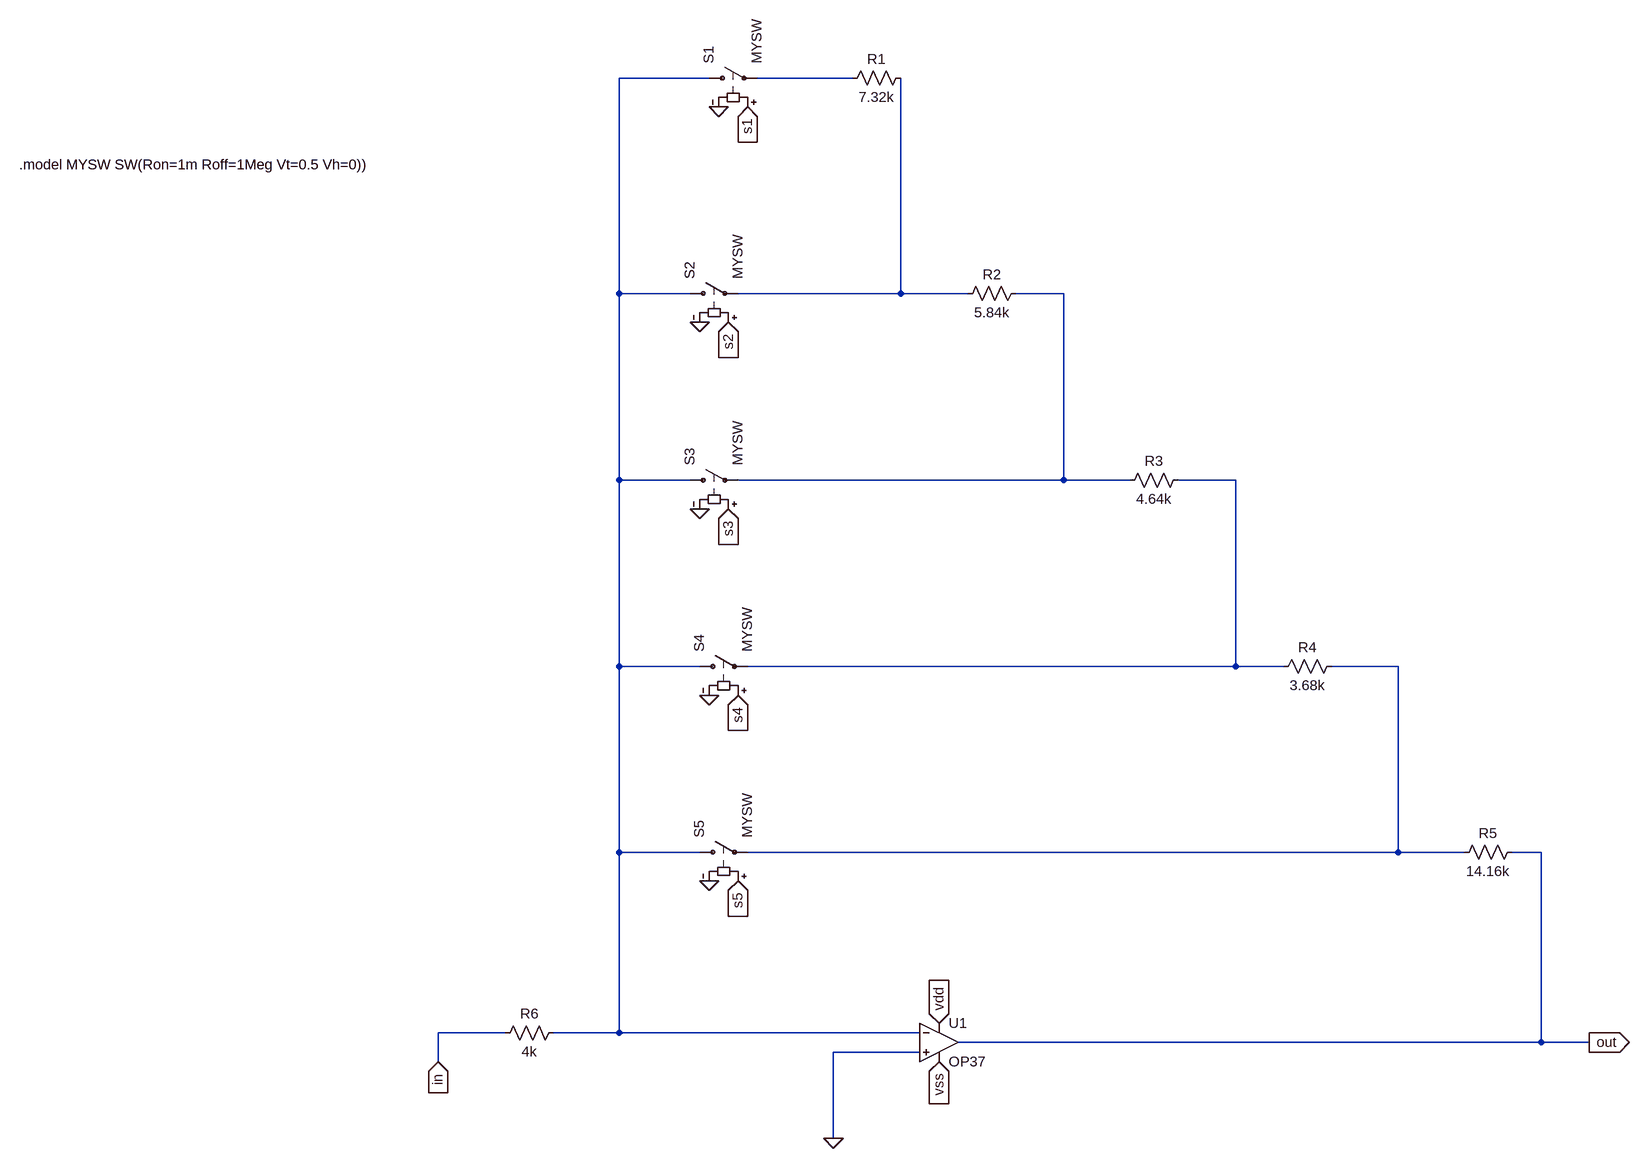
[diagram p0: schematic etj3.asc]
etj3.asc, the LTspice schematic file:
Version 4
SHEET 1 2480 2132
WIRE 736 -288 448 -288
WIRE 1040 -288 816 -288
WIRE 448 96 448 -288
WIRE 704 96 448 96
WIRE 1120 96 1120 -288
WIRE 1120 96 784 96
WIRE 1232 96 1120 96
WIRE 1392 96 1312 96
WIRE 448 544 448 96
WIRE 704 544 448 544
WIRE 1392 544 1392 96
WIRE 1392 544 784 544
WIRE 1504 544 1392 544
WIRE 1680 544 1584 544
WIRE 448 1008 448 544
WIRE 720 1008 448 1008
WIRE 1680 1008 1680 544
WIRE 1680 1008 800 1008
WIRE 1760 1008 1680 1008
WIRE 1968 1008 1840 1008
WIRE 448 1456 448 1008
WIRE 720 1456 448 1456
WIRE 1968 1456 1968 1008
WIRE 1968 1456 800 1456
WIRE 2176 1456 1968 1456
WIRE 2304 1456 2256 1456
WIRE 48 1904 -64 1904
WIRE 448 1904 448 1456
WIRE 448 1904 128 1904
WIRE 1152 1904 448 1904
WIRE 2304 1920 2304 1456
WIRE 2304 1920 1216 1920
WIRE 2384 1920 2304 1920
WIRE 1152 1936 1008 1936
WIRE -64 1952 -64 1904
WIRE 1008 2080 1008 1936
FLAG 1008 2080 0
FLAG 752 -240 0
FLAG 720 592 0
FLAG 736 1056 0
FLAG 736 1504 0
FLAG 800 -240 s1
IOPIN 800 -240 In
FLAG 720 144 0
FLAG 768 144 s2
IOPIN 768 144 In
FLAG 768 592 s3
IOPIN 768 592 In
FLAG 784 1056 s4
IOPIN 784 1056 In
FLAG 784 1504 s5
IOPIN 784 1504 In
FLAG 1184 1888 vdd
IOPIN 1184 1888 In
FLAG 1184 1952 vss
IOPIN 1184 1952 In
FLAG -64 1952 in
IOPIN -64 1952 In
FLAG 2384 1920 out
IOPIN 2384 1920 Out
DATAFLAG 2304 1920 ""
SYMBOL res 1136 -304 R90
WINDOW 0 0 56 VBottom 2
WINDOW 3 32 56 VTop 2
SYMATTR InstName R1
SYMATTR Value 7.32k
SYMBOL res 1328 80 R90
WINDOW 0 0 56 VBottom 2
WINDOW 3 32 56 VTop 2
SYMATTR InstName R2
SYMATTR Value 5.84k
SYMBOL res 1600 528 R90
WINDOW 0 0 56 VBottom 2
WINDOW 3 32 56 VTop 2
SYMATTR InstName R3
SYMATTR Value 4.64k
SYMBOL res 1856 992 R90
WINDOW 0 0 56 VBottom 2
WINDOW 3 32 56 VTop 2
SYMATTR InstName R4
SYMATTR Value 3.68k
SYMBOL res 2272 1440 R90
WINDOW 0 0 56 VBottom 2
WINDOW 3 32 56 VTop 2
SYMATTR InstName R5
SYMATTR Value 14.16k
SYMBOL res 144 1888 R90
WINDOW 0 0 56 VBottom 2
WINDOW 3 32 56 VTop 2
SYMATTR InstName R6
SYMATTR Value 4k
SYMBOL OpAmps\\OP37 1184 1856 R0
SYMATTR InstName U1
SYMBOL sw 720 -288 R270
SYMATTR InstName S1
SYMATTR Value MYSW
SYMBOL sw 688 544 R270
SYMATTR InstName S3
SYMATTR Value MYSW
SYMBOL sw 704 1008 R270
SYMATTR InstName S4
SYMATTR Value MYSW
SYMBOL sw 704 1456 R270
SYMATTR InstName S5
SYMATTR Value MYSW
SYMBOL sw 688 96 R270
SYMATTR InstName S2
SYMATTR Value MYSW
TEXT -1064 -144 Left 2 !.model MYSW SW(Ron=1m Roff=1Meg Vt=0.5 Vh=0))

The netlist it stands for:
* etj3.asc
R1 N003 N002 7.32k
R2 N004 N003 5.84k
R3 N005 N004 4.64k
R4 N006 N005 3.68k
R5 out N006 14.16k
R6 N001 in 4k
XU1 0 N001 vdd vss out LT1037  ; OP37, pins In+ In- V+ V- OUT
S1 N001 N002 s1 0 MYSW
S3 N001 N004 s3 0 MYSW
S4 N001 N005 s4 0 MYSW
S5 N001 N006 s5 0 MYSW
S2 N001 N003 s2 0 MYSW
.model MYSW SW(Ron=1m Roff=1Meg Vt=0.5 Vh=0))
.lib LTC.lib
.backanno
.end